# EasyEDA schematic SCH_New Project_2022-11-03.json
TITLE: Sheet_1; REV: 1.0; Date: 2022-10-19; Sheet: 1/1; Drawn By: ronaldparicanaza; Company: Your Company
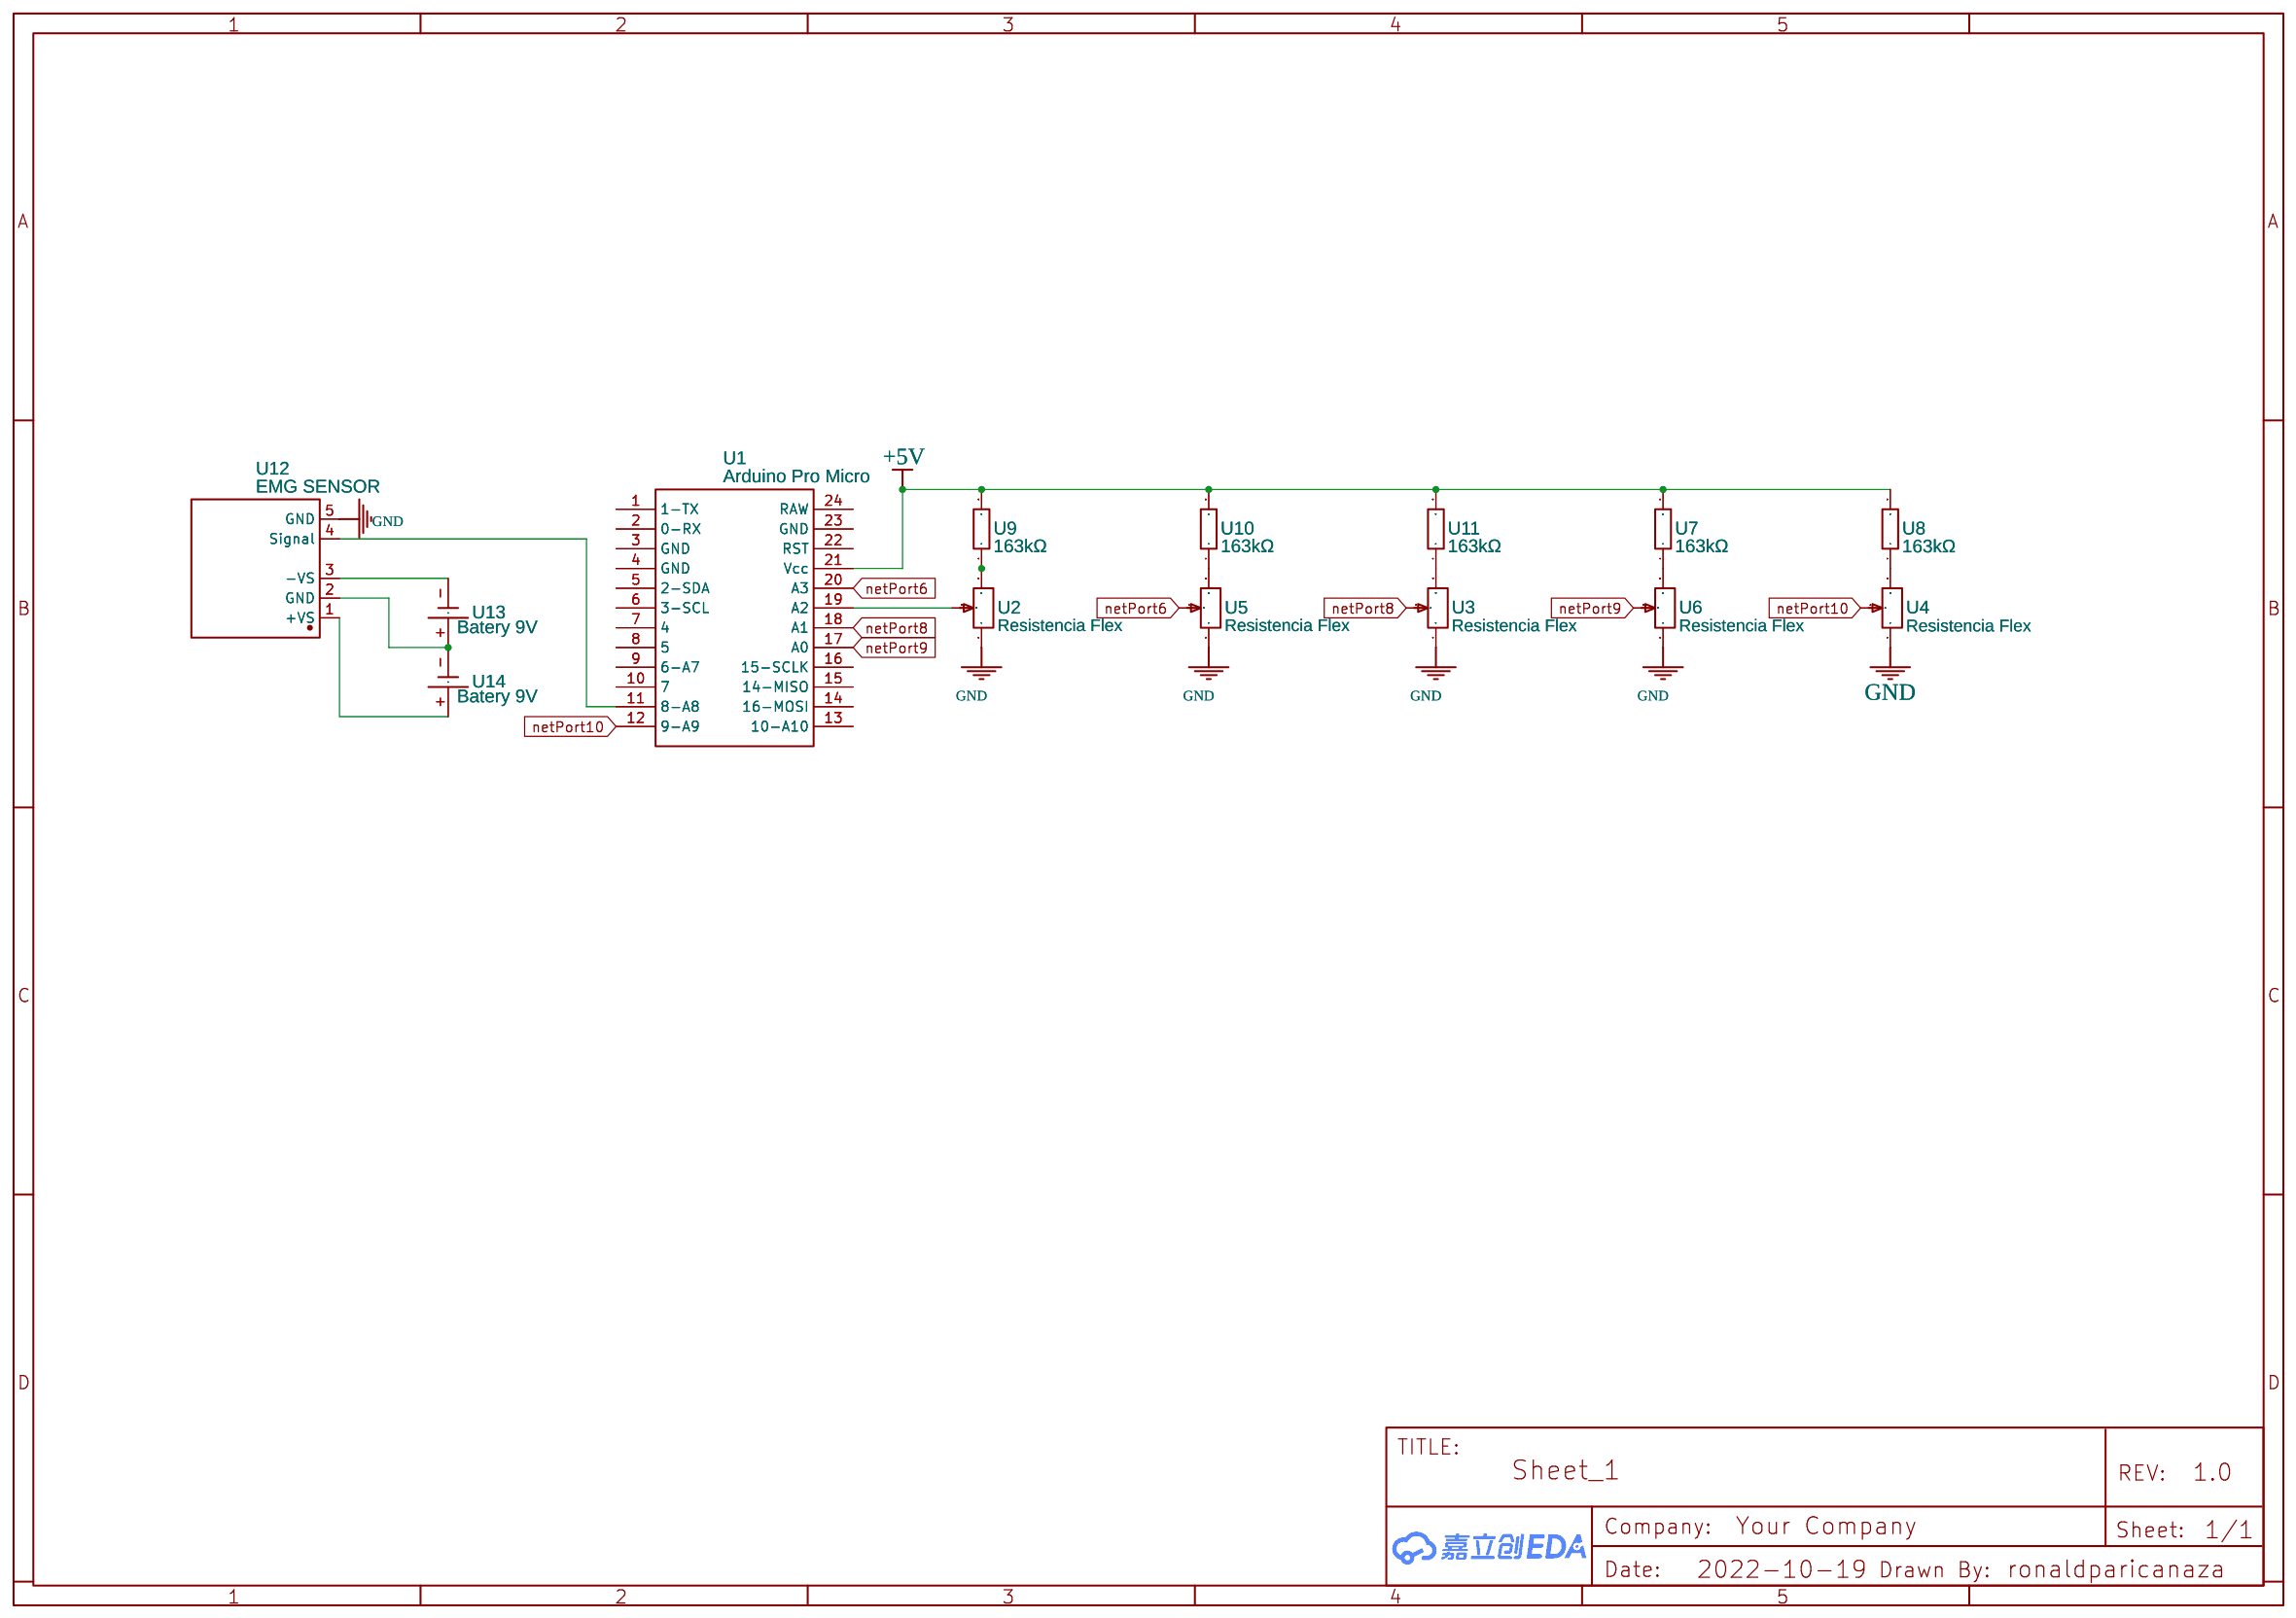
[diagram p0: schematic sheet]

## Parts
U1  Arduino Pro Micro  [ARDUINOPROMICRO]
U2  Resistencia Flex  [RES-ADJ-SMD_VG039NCH]
U3  Resistencia Flex  [RES-ADJ-SMD_VG039NCH]
U4  Resistencia Flex  [RES-ADJ-SMD_VG039NCH]
U5  Resistencia Flex  [RES-ADJ-SMD_VG039NCH]
U6  Resistencia Flex  [RES-ADJ-SMD_VG039NCH]
U7  163kΩ  [R0402]
U8  163kΩ  [R0402]
U9  163kΩ  [R0402]
U10  163kΩ  [R0402]
U11  163kΩ  [R0402]
U12  EMG SENSOR
U13  Batery 9V  [BATERY]
U14  Batery 9V  [BATERY]

## Library data of the parts
U1 = Arduino Pro Micro: Contributor: AtifIqbal
U2-U6 = 3*3POTENTIOMETER-10KΩ20%: Supplier: LCSC; Supplier Part: C9900010776; Manufacturer: null; Manufacturer Part: 3*3Potentiometer-10kΩ20%; link: https://atta.szlcsc.comnull; Contributor: LCSC; JLCPCB Part Class: Extended Part
U7-U11 = HPCR0402F475KK9: Supplier: LCSC; Supplier Part: C365017; Manufacturer: ResistorToday; Resistance (Ohms): 475K; Contributor: LCSC; JLCPCB Part Class: Extended Part
U12 = EMG SENSOR: Contributor: liono339
U13 U14 = Batery: Contributor: vydrysekg

## Nets
+5V: U1.21(Vcc) U7.2 U8.2 U9.2 U10.2 U11.2
GND: U2.1 U3.1 U4.1 U5.1 U6.1 U12.5(GND)
netPort6: U1.20(A3) U5.2
netPort8: U1.18(A1) U3.2
netPort9: U1.17(A0) U6.2
netPort10: U1.12(9-A9) U4.2
Net-(U1-11): U1.11(8-A8) U12.4(Signal)
Net-(U1-19): U1.19(A2) U2.2
Net-(U2-3): U2.3 U9.1
Net-(U3-3): U3.3 U11.1
Net-(U4-3): U4.3 U8.1
Net-(U5-3): U5.3 U10.1
Net-(U6-3): U6.3 U7.1
Net-(U12-1): U12.1(+VS) U14.+
Net-(U12-2): U12.2(GND) U13.+ U14.-
Net-(U12-3): U12.3(-VS) U13.-

Not connected (* = marked no-connect by the designer): U1 1(1-TX) 2(0-RX) 3(GND) 4(GND) 5(2-SDA) 6(3-SCL) 7(4) 8(5) 9(6-A7) 10(7) 13(10-A10) 14(16-MOSI) 15(14-MISO) 16(15-SCLK) 22(RST) 23(GND) 24(RAW)
